# EAGLE schematic przetwornice (EAGLE 5.06)
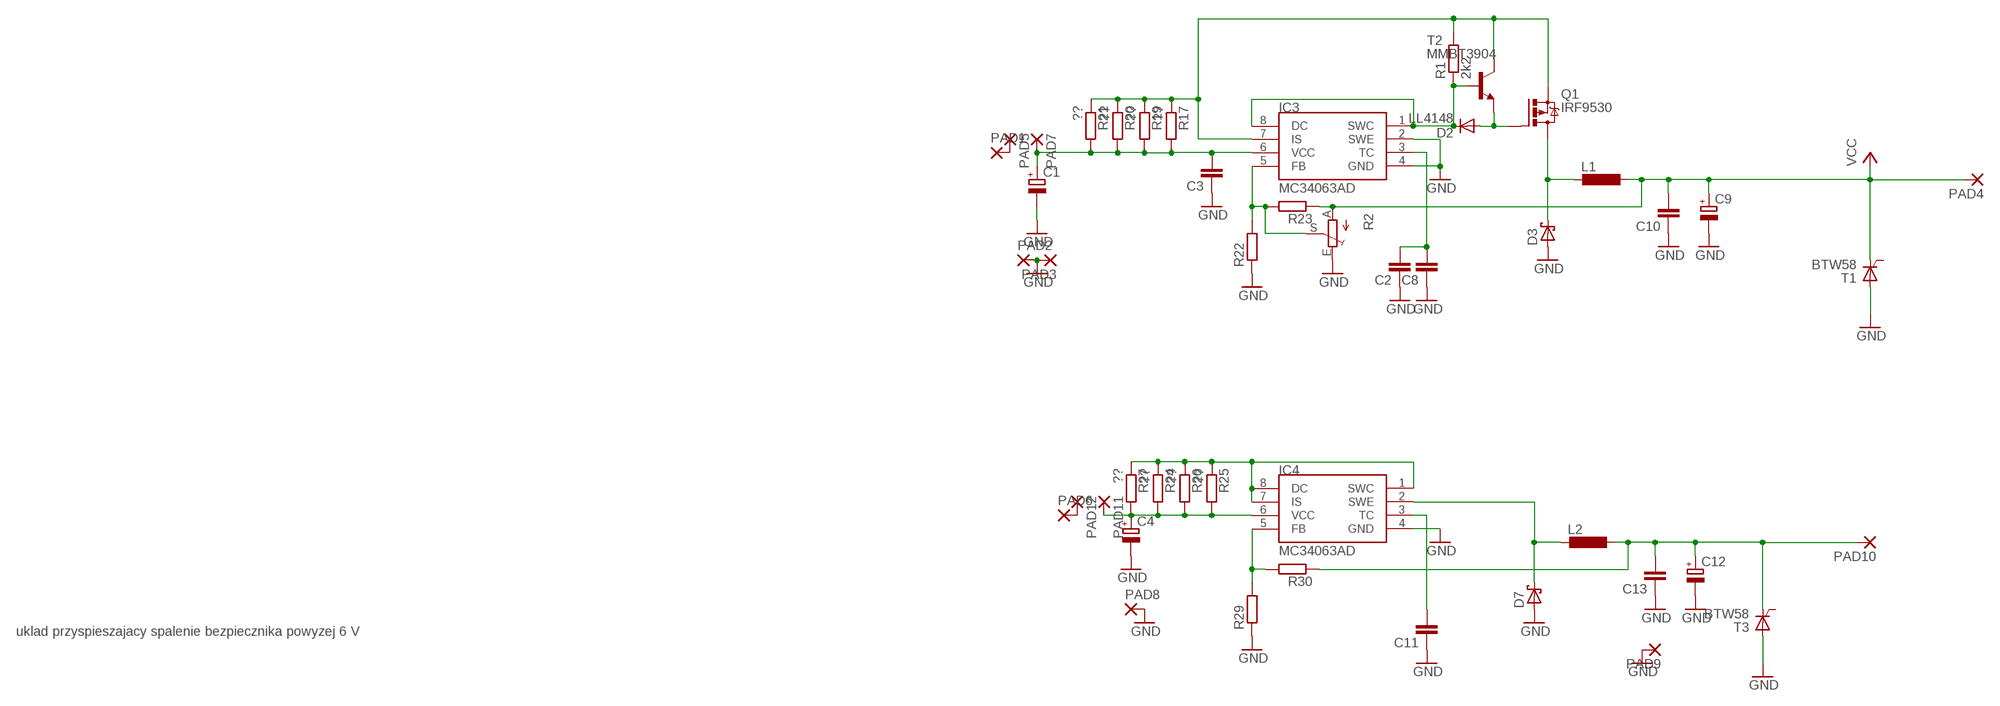
[diagram p0: schematic, sheet 1]

## Parts
C1  CPOL-EUE3.5-8  [E3,5-8]
C2  CAP  [0805]
C3  CAP  [0805]
C4  CPOL-EUE  [PANASONIC_E]
C8  CAP  [0805]
C9  CPOL-EUE3.5-10  [E3,5-10]
C10  CAP  [0805]
C11  CAP  [0805]
C12  CPOL-EUE  [PANASONIC_E]
C13  CAP  [0805]
D2  LL4148  DIODE-SOD110-W  [SOD110-W]
D3  SCHOTTKY-DIODESMC  [SMC]
D7  SCHOTTKY-DIODESMD  [SMB]
IC3  MC34063AD  [SOIC8]
IC4  MC34063AD  [SOIC8]
L1  DO3316P  [DO3316P]
L2  DO3316P  [DO3316P]
PAD1  2,15/1,0  [2,15/1,0]
PAD2  2,15/1,0  [2,15/1,0]
PAD3  2,15/1,0  [2,15/1,0]
PAD4  2,15/1,0  [2,15/1,0]
PAD5  1,6/0,8  [1,6/0,8]
PAD6  2,15/1,0  [2,15/1,0]
PAD7  1,6/0,8  [1,6/0,8]
PAD8  2,15/1,0  [2,15/1,0]
PAD9  2,15/1,0  [2,15/1,0]
PAD10  2,15/1,0  [2,15/1,0]
PAD11  1,6/0,8  [1,6/0,8]
PAD12  1,6/0,8  [1,6/0,8]
Q1  IRF9530  [TO220BV]
R1  2k2  RES0805  [0805]
R2  TRIM_EU-B64Y  [B64Y]
R17  ??  R-EU_R1206  [R1206]
R19  ??  R-EU_R1206  [R1206]
R20  ??  R-EU_R1206  [R1206]
R21  ??  R-EU_R1206  [R1206]
R22  RES0805  [0805]
R23  RES0805  [0805]
R24  ??  R-EU_R1206  [R1206]
R25  ??  R-EU_R1206  [R1206]
R26  ??  R-EU_R1206  [R1206]
R27  ??  R-EU_R1206  [R1206]
R29  RES0805  [0805]
R30  RES0805  [0805]
T1  BTW58  [TO220CS]
T2  MMBT3904  BC817-16-NPN-SOT23-BEC  [SOT23-BEC]
T3  BTW58  [TO220CS]

## Nets
CHOKE1: D3.C L1.1 Q1.D
GND: C1.- C2.1 C3.1 C4.- C8.1 C9.- C10.1 C11.1 C12.- C13.1 D3.A D7.A IC3.2(SWE) IC3.4(GND) IC4.4(GND) PAD2.1(P) PAD3.1(P) PAD8.1(P) PAD9.1(P) R2.E R22.1 R29.1 T1.A T3.A
N$1: D2.C IC3.1(SWC) IC3.8(DC) R1.1 T2.B
N$2: C1.+ C3.2 IC3.6(VCC) PAD7.1(P) R17.2 R19.2 R20.2 R21.2
N$3: C4.+ IC4.6(VCC) PAD11.1(P) R24.2 R25.2 R26.2 R27.2
N$5: PAD1.1(P) PAD5.1(P)
N$6: C12.+ C13.2 L2.2 PAD10.1(P) R30.1 T3.C
N$7: PAD6.1(P) PAD12.1(P)
N$16: IC3.7(IS) Q1.S R1.2 R17.1 R19.1 R20.1 R21.1 T2.C
N$23: IC3.5(FB) R2.S R22.2 R23.2
N$29: C2.2 C8.2 IC3.3(TC)
N$30: IC4.1(SWC) IC4.7(IS) IC4.8(DC) R24.1 R25.1 R26.1 R27.1
N$31: IC4.5(FB) R29.2 R30.2
N$32: D2.A Q1.G T2.E
N$44: C11.2 IC4.3(TC)
N$53: D7.C IC4.2(SWE) L2.1
VCC: C9.+ C10.2 L1.2 PAD4.1(P) R2.A R23.1 T1.C
Unconnected: T1.G T3.G

## Notes on the sheet
- uklad przyspieszajacy spalenie bezpiecznika powyzej 6 V

## Library data of the parts
C1 C4 C9 C12 = rcl:CPOL-EU: POLARIZED CAPACITOR, European symbol
C2 C3 C8 C10 C11 C13 = barobot:CAP
D2 = diode:DIODE-: DIODE
D3 D7 = diode:SCHOTTKY-DIODE: Schottky Diode
IC3 IC4 = mc34063:MC34063
L1 L2 = inductor-coilcraft:DO3316P: COILCRAFT
PAD1-PAD4 PAD6 PAD8-PAD10 = wirepad:2,15/1,0: THROUGH-HOLE PAD
PAD5 PAD7 PAD11 PAD12 = wirepad:1,6/0,8: THROUGH-HOLE PAD
Q1 = transistor-power:IRF9530: P-CHANNEL HEXFET POWER-MOS-FET Source: http://www.irf.com/product-info/datasheets/data/irf9530.pdf
R1 R22 R23 R29 R30 = barobot:RES
R2 = pot:TRIM_EU-: POTENTIOMETER
R17 R19-R21 R24-R27 = resistor:R-EU_: RESISTOR, European symbol
T1 T3 = triac:BTW58: THYRISTOR
T2 = transistor:*-NPN-: NPN Transistror BF959 corrected 2008.03.06